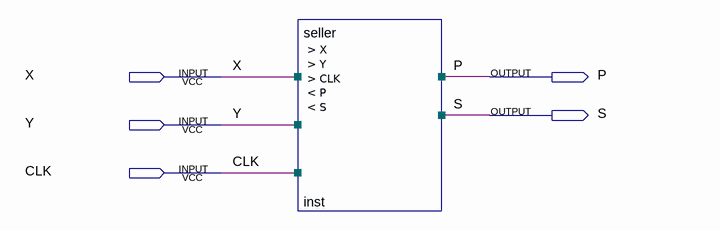
[diagram p0: schematic sheet]
// Quartus schematic autoseller.bdf as structural Verilog: 1 symbols, 5 pins
module autoseller (
  input  X,
  input  Y,
  input  CLK,
  output P,
  output S
);

  seller inst (.X(X), .Y(Y), .CLK(CLK), .P(P), .S(S));
endmodule
